# Altium schematic sheet mcu.schdoc
size A3; Organization: Altium Limited; Address1: L3, 12a Rodborough Rd; Address2: Frenchs Forest; Address3: NSW; Address4: Australia 2086
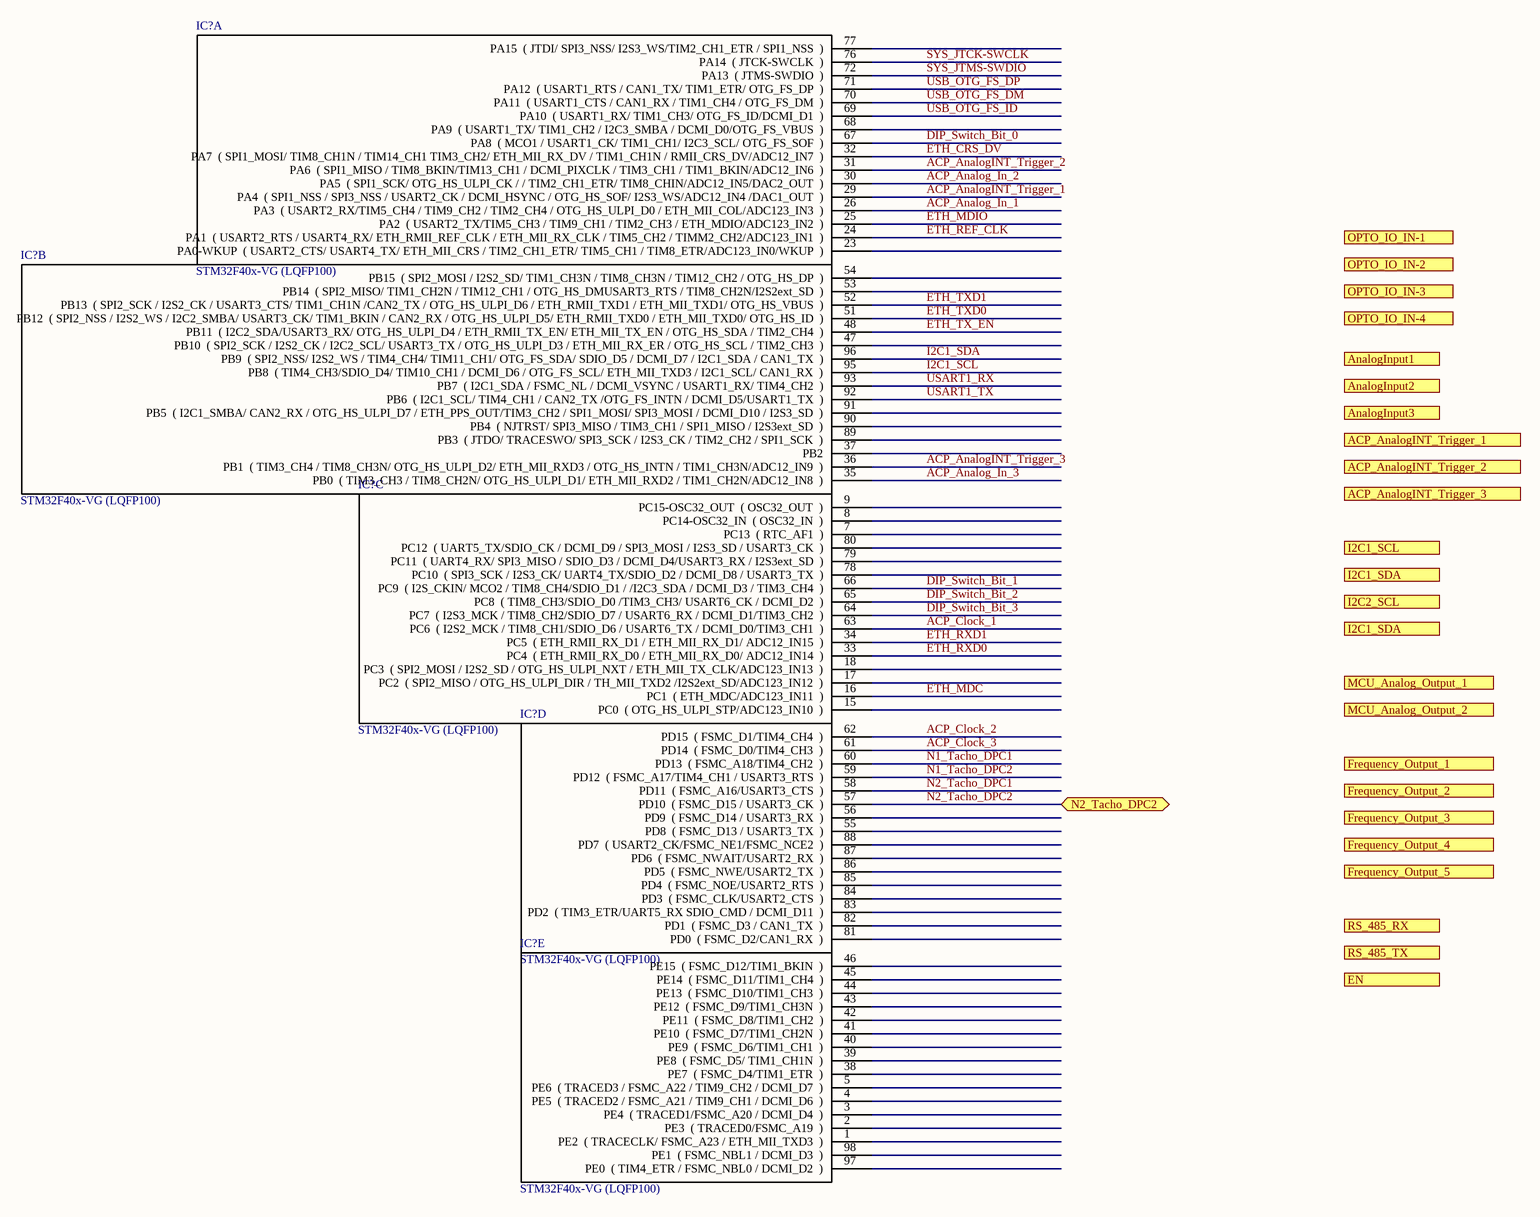
[diagram p0: mcu.schdoc]

## Parts
(Parts that share a designator on the sheet are numbered #1, #2 ... from top to bottom, then left to right.)
IC?#1  STM32F40x-VG (LQFP100)  [LQFP100]  (part A of 6)
IC?#2  STM32F40x-VG (LQFP100)  [LQFP100]  (part B of 6)
IC?#3  STM32F40x-VG (LQFP100)  [LQFP100]  (part C of 6)
IC?#4  STM32F40x-VG (LQFP100)  [LQFP100]  (part D of 6)
IC?#5  STM32F40x-VG (LQFP100)  [LQFP100]  (part E of 6)

## Ports
ACP_AnalogINT_Trigger_1, ACP_AnalogINT_Trigger_2, ACP_AnalogINT_Trigger_3, AnalogInput1, AnalogInput2, AnalogInput3, EN, Frequency_Output_1, Frequency_Output_2, Frequency_Output_3, Frequency_Output_4, Frequency_Output_5, I2C1_SCL, I2C1_SDA, I2C2_SCL, MCU_Analog_Output_1, MCU_Analog_Output_2, N2_Tacho_DPC2 (bidir), OPTO_IO_IN-1, OPTO_IO_IN-2, OPTO_IO_IN-3, OPTO_IO_IN-4, RS_485_RX, RS_485_TX

## Nets
ACP_Analog_In_1: IC?#1.26(PA3__(_USART2_RX/TIM5_CH4_/_TIM9_CH2_/_TIM2_CH4_/_OTG_HS_ULPI_D0_/_ETH_MII_COL/ADC123_IN3__))
ACP_Analog_In_2: IC?#1.30(PA5__(_SPI1_SCK/_OTG_HS_ULPI_CK_/_/_TIM2_CH1_ETR/_TIM8_CHIN/ADC12_IN5/DAC2_OUT__))
ACP_Analog_In_3: IC?#2.35(PB0__(_TIM3_CH3_/_TIM8_CH2N/_OTG_HS_ULPI_D1/_ETH_MII_RXD2_/_TIM1_CH2N/ADC12_IN8__))
ACP_AnalogINT_Trigger_1: IC?#1.29(PA4__(_SPI1_NSS_/_SPI3_NSS_/_USART2_CK_/_DCMI_HSYNC_/_OTG_HS_SOF/_I2S3_WS/ADC12_IN4_/DAC1_OUT__))
ACP_AnalogINT_Trigger_2: IC?#1.31(PA6__(_SPI1_MISO_/_TIM8_BKIN/TIM13_CH1_/_DCMI_PIXCLK_/_TIM3_CH1_/_TIM1_BKIN/ADC12_IN6__))
ACP_AnalogINT_Trigger_3: IC?#2.36(PB1__(_TIM3_CH4_/_TIM8_CH3N/_OTG_HS_ULPI_D2/_ETH_MII_RXD3_/_OTG_HS_INTN_/_TIM1_CH3N/ADC12_IN9__))
ACP_Clock_1: IC?#3.63(PC6__(_I2S2_MCK_/_TIM8_CH1/SDIO_D6_/_USART6_TX_/_DCMI_D0/TIM3_CH1__))
ACP_Clock_2: IC?#4.62(PD15__(_FSMC_D1/TIM4_CH4__))
ACP_Clock_3: IC?#4.61(PD14__(_FSMC_D0/TIM4_CH3__))
DIP_Switch_Bit_0: IC?#1.67(PA8__(_MCO1_/_USART1_CK/_TIM1_CH1/_I2C3_SCL/_OTG_FS_SOF__))
DIP_Switch_Bit_1: IC?#3.66(PC9__(_I2S_CKIN/_MCO2_/_TIM8_CH4/SDIO_D1_/_/I2C3_SDA_/_DCMI_D3_/_TIM3_CH4__))
DIP_Switch_Bit_2: IC?#3.65(PC8__(_TIM8_CH3/SDIO_D0_/TIM3_CH3/_USART6_CK_/_DCMI_D2__))
DIP_Switch_Bit_3: IC?#3.64(PC7__(_I2S3_MCK_/_TIM8_CH2/SDIO_D7_/_USART6_RX_/_DCMI_D1/TIM3_CH2__))
ETH_CRS_DV: IC?#1.32(PA7__(_SPI1_MOSI/_TIM8_CH1N_/_TIM14_CH1_TIM3_CH2/_ETH_MII_RX_DV_/_TIM1_CH1N_/_RMII_CRS_DV/ADC12_IN7__))
ETH_MDC: IC?#3.16(PC1__(_ETH_MDC/ADC123_IN11__))
ETH_MDIO: IC?#1.25(PA2__(_USART2_TX/TIM5_CH3_/_TIM9_CH1_/_TIM2_CH3_/_ETH_MDIO/ADC123_IN2__))
ETH_REF_CLK: IC?#1.24(PA1__(_USART2_RTS_/_USART4_RX/_ETH_RMII_REF_CLK_/_ETH_MII_RX_CLK_/_TIM5_CH2_/_TIMM2_CH2/ADC123_IN1__))
ETH_RXD0: IC?#3.33(PC4__(_ETH_RMII_RX_D0_/_ETH_MII_RX_D0/_ADC12_IN14__))
ETH_RXD1: IC?#3.34(PC5__(_ETH_RMII_RX_D1_/_ETH_MII_RX_D1/_ADC12_IN15__))
ETH_TX_EN: IC?#2.48(PB11__(_I2C2_SDA/USART3_RX/_OTG_HS_ULPI_D4_/_ETH_RMII_TX_EN/_ETH_MII_TX_EN_/_OTG_HS_SDA_/_TIM2_CH4__))
ETH_TXD0: IC?#2.51(PB12__(_SPI2_NSS_/_I2S2_WS_/_I2C2_SMBA/_USART3_CK/_TIM1_BKIN_/_CAN2_RX_/_OTG_HS_ULPI_D5/_ETH_RMII_TXD0_/_ETH_MII_TXD0/_OTG_HS_ID__))
ETH_TXD1: IC?#2.52(PB13__(_SPI2_SCK_/_I2S2_CK_/_USART3_CTS/_TIM1_CH1N_/CAN2_TX_/_OTG_HS_ULPI_D6_/_ETH_RMII_TXD1_/_ETH_MII_TXD1/_OTG_HS_VBUS__))
I2C1_SCL: IC?#2.95(PB8__(_TIM4_CH3/SDIO_D4/_TIM10_CH1_/_DCMI_D6_/_OTG_FS_SCL/_ETH_MII_TXD3_/_I2C1_SCL/_CAN1_RX__))
I2C1_SDA: IC?#2.96(PB9__(_SPI2_NSS/_I2S2_WS_/_TIM4_CH4/_TIM11_CH1/_OTG_FS_SDA/_SDIO_D5_/_DCMI_D7_/_I2C1_SDA_/_CAN1_TX__))
N1_Tacho_DPC1: IC?#4.60(PD13__(_FSMC_A18/TIM4_CH2__))
N1_Tacho_DPC2: IC?#4.59(PD12__(_FSMC_A17/TIM4_CH1_/_USART3_RTS__))
N2_Tacho_DPC1: IC?#4.58(PD11__(_FSMC_A16/USART3_CTS__))
N2_Tacho_DPC2: IC?#4.57(PD10__(_FSMC_D15_/_USART3_CK__)) ; port N2_Tacho_DPC2
SYS_JTCK-SWCLK: IC?#1.76(PA14__(_JTCK-SWCLK__))
SYS_JTMS-SWDIO: IC?#1.72(PA13__(_JTMS-SWDIO__))
USART1_RX: IC?#2.93(PB7__(_I2C1_SDA_/_FSMC_NL_/_DCMI_VSYNC_/_USART1_RX/_TIM4_CH2__))
USART1_TX: IC?#2.92(PB6__(_I2C1_SCL/_TIM4_CH1_/_CAN2_TX_/OTG_FS_INTN_/_DCMI_D5/USART1_TX__))
USB_OTG_FS_DM: IC?#1.70(PA11__(_USART1_CTS_/_CAN1_RX_/_TIM1_CH4_/_OTG_FS_DM__))
USB_OTG_FS_DP: IC?#1.71(PA12__(_USART1_RTS_/_CAN1_TX/_TIM1_ETR/_OTG_FS_DP__))
USB_OTG_FS_ID: IC?#1.69(PA10__(_USART1_RX/_TIM1_CH3/_OTG_FS_ID/DCMI_D1__))

Not connected (* = marked no-connect by the designer): IC?#1 23(PA0-WKUP__(_USART2_CTS/_USART4_TX/_ETH_MII_CRS_/_TIM2_CH1_ETR/_TIM5_CH1_/_TIM8_ETR/ADC123_IN0/WKUP__)) 68(PA9__(_USART1_TX/_TIM1_CH2_/_I2C3_SMBA_/_DCMI_D0/OTG_FS_VBUS__)) 77(PA15__(_JTDI/_SPI3_NSS/_I2S3_WS/TIM2_CH1_ETR_/_SPI1_NSS__)); IC?#2 37(PB2) 47(PB10__(_SPI2_SCK_/_I2S2_CK_/_I2C2_SCL/_USART3_TX_/_OTG_HS_ULPI_D3_/_ETH_MII_RX_ER_/_OTG_HS_SCL_/_TIM2_CH3__)) 53(PB14__(_SPI2_MISO/_TIM1_CH2N_/_TIM12_CH1_/_OTG_HS_DMUSART3_RTS_/_TIM8_CH2N/I2S2ext_SD__)) 54(PB15__(_SPI2_MOSI_/_I2S2_SD/_TIM1_CH3N_/_TIM8_CH3N_/_TIM12_CH2_/_OTG_HS_DP__)) 89(PB3__(_JTDO/_TRACESWO/_SPI3_SCK_/_I2S3_CK_/_TIM2_CH2_/_SPI1_SCK__)) 90(PB4__(_NJTRST/_SPI3_MISO_/_TIM3_CH1_/_SPI1_MISO_/_I2S3ext_SD__)) 91(PB5__(_I2C1_SMBA/_CAN2_RX_/_OTG_HS_ULPI_D7_/_ETH_PPS_OUT/TIM3_CH2_/_SPI1_MOSI/_SPI3_MOSI_/_DCMI_D10_/_I2S3_SD__)); IC?#3 7(PC13__(_RTC_AF1__)) 8(PC14-OSC32_IN__(_OSC32_IN__)) 9(PC15-OSC32_OUT__(_OSC32_OUT__)) 15(PC0__(_OTG_HS_ULPI_STP/ADC123_IN10__)) 17(PC2__(_SPI2_MISO_/_OTG_HS_ULPI_DIR_/_TH_MII_TXD2_/I2S2ext_SD/ADC123_IN12__)) 18(PC3__(_SPI2_MOSI_/_I2S2_SD_/_OTG_HS_ULPI_NXT_/_ETH_MII_TX_CLK/ADC123_IN13__)) 78(PC10__(_SPI3_SCK_/_I2S3_CK/_UART4_TX/SDIO_D2_/_DCMI_D8_/_USART3_TX__)) 79(PC11__(_UART4_RX/_SPI3_MISO_/_SDIO_D3_/_DCMI_D4/USART3_RX_/_I2S3ext_SD__)) 80(PC12__(_UART5_TX/SDIO_CK_/_DCMI_D9_/_SPI3_MOSI_/_I2S3_SD_/_USART3_CK__)); IC?#4 55(PD8__(_FSMC_D13_/_USART3_TX__)) 56(PD9__(_FSMC_D14_/_USART3_RX__)) 81(PD0__(_FSMC_D2/CAN1_RX__)) 82(PD1__(_FSMC_D3_/_CAN1_TX__)) 83(PD2__(_TIM3_ETR/UART5_RX_SDIO_CMD_/_DCMI_D11__)) 84(PD3__(_FSMC_CLK/USART2_CTS__)) 85(PD4__(_FSMC_NOE/USART2_RTS__)) 86(PD5__(_FSMC_NWE/USART2_TX__)) 87(PD6__(_FSMC_NWAIT/USART2_RX__)) 88(PD7__(_USART2_CK/FSMC_NE1/FSMC_NCE2__)); IC?#5 1(PE2__(_TRACECLK/_FSMC_A23_/_ETH_MII_TXD3__)) 2(PE3__(_TRACED0/FSMC_A19__)) 3(PE4__(_TRACED1/FSMC_A20_/_DCMI_D4__)) 4(PE5__(_TRACED2_/_FSMC_A21_/_TIM9_CH1_/_DCMI_D6__)) 5(PE6__(_TRACED3_/_FSMC_A22_/_TIM9_CH2_/_DCMI_D7__)) 38(PE7__(_FSMC_D4/TIM1_ETR__)) 39(PE8__(_FSMC_D5/_TIM1_CH1N__)) 40(PE9__(_FSMC_D6/TIM1_CH1__)) 41(PE10__(_FSMC_D7/TIM1_CH2N__)) 42(PE11__(_FSMC_D8/TIM1_CH2__)) 43(PE12__(_FSMC_D9/TIM1_CH3N__)) 44(PE13__(_FSMC_D10/TIM1_CH3__)) 45(PE14__(_FSMC_D11/TIM1_CH4__)) 46(PE15__(_FSMC_D12/TIM1_BKIN__)) 97(PE0__(_TIM4_ETR_/_FSMC_NBL0_/_DCMI_D2__)) 98(PE1__(_FSMC_NBL1_/_DCMI_D3__))

## Notes on the sheet
- Title
- Size:
- Date:
- A3
- Number:
- Time:
- Revision:
- Sheet
- of
- File:

## Library data of the parts
IC?#1-IC?#5 = STM32F40x-VG